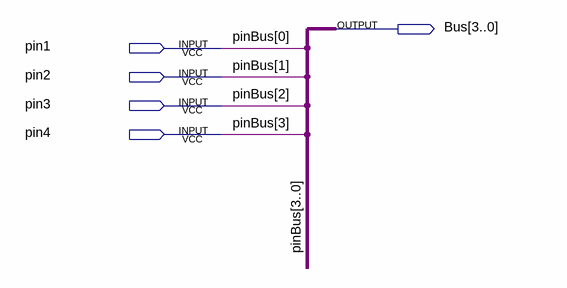
[diagram p0: schematic sheet]
// Quartus schematic BusX4.bdf as structural Verilog: 0 symbols, 5 pins
module BusX4 (
  input  pin1,
  input  pin2,
  input  pin3,
  input  pin4,
  output [3:0] Bus
);


  assign Bus = {pin4, pin3, pin2, pin1};

  // Other names for the same wires on the sheet: pinBus[3:0] = {pin4, pin3, pin2, pin1}
endmodule
